# Altium schematic sheet ModMicroController.SchDoc
size 420 x 297 mm; Address1: Address1; Address2: Address2; Address3: Address3; Address4: Address4; SheetNumber: 1; Scale: 1:1; Разраб.: Лепотенко А.С.; Обозначение документа: ЛАС.4367523.002Э3; Перв. применение: ЛАС.4367523.002; Наименование изделия 1: Контроллер управления; Наименование изделия 2: Схема электрическая; Наименование изделия 3: принципиальная; Нач. отд.: Нач. отд.
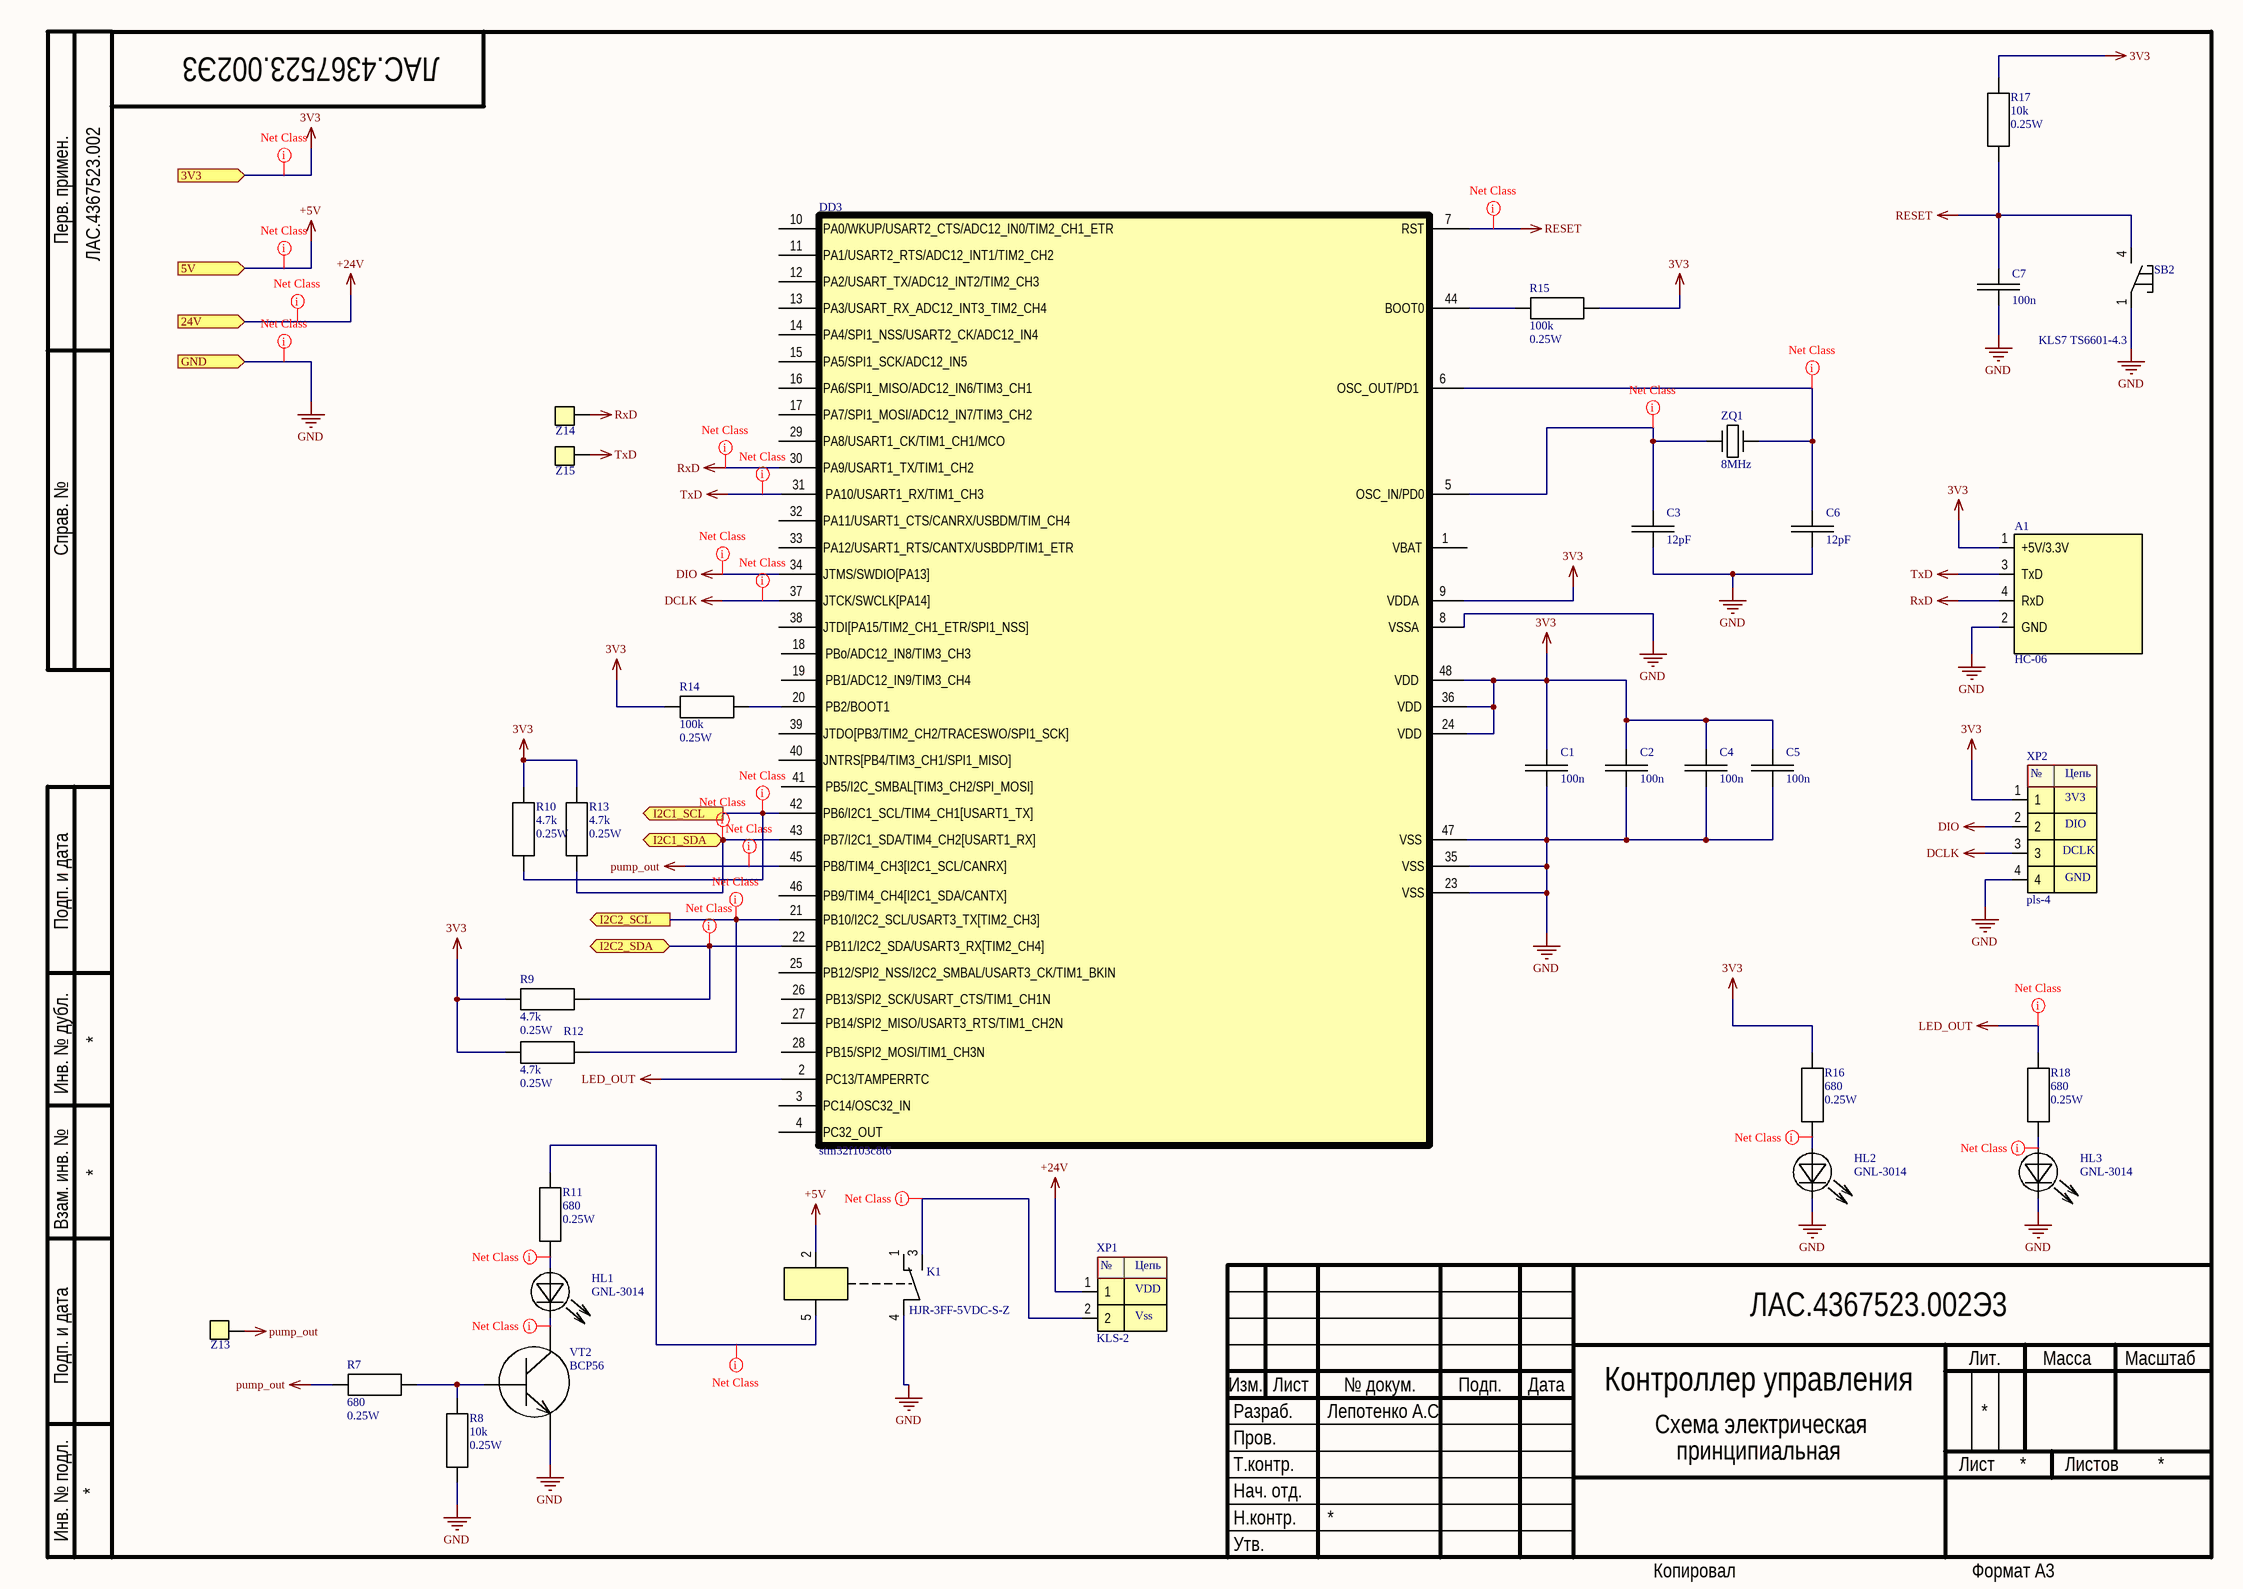
[diagram p0: ModMicroController.SchDoc]

## Parts
A1  HC-06  [HC-06]
C1  100n  [CAP1206]
C2  100n  [CAP1206]
C3  12pF  [CAP1206]
C4  100n  [CAP1206]
C5  100n  [CAP1206]
C6  12pF  [CAP1206]
C7  100n  [CAP1206]
DD3  stm32f103c8t6  [LQFP48]
HL1  GNL-3014  [GNL-3014]
HL2  GNL-3014  [GNL-3014]
HL3  GNL-3014  [GNL-3014]
K1  HJR-3FF-5VDC-S-Z  [HJR-3FF]
R7  Power: 0.25W  [1206]  (hidden comment: 680)
R8  Power: 0.25W  [1206]  (hidden comment: 10k)
R9  value 4.7k  Power: 0.25W  [1206]  (hidden comment: 4k7)
R10  value 4.7k  Power: 0.25W  [1206]  (hidden comment: 4k7)
R11  Power: 0.25W  [1206]  (hidden comment: 680)
R12  value 4.7k  Power: 0.25W  [1206]  (hidden comment: 4k7)
R13  value 4.7k  Power: 0.25W  [1206]  (hidden comment: 4k7)
R14  value 100k  Power: 0.25W  [1206]  (hidden comment: Resistor)
R15  value 100k  Power: 0.25W  [1206]  (hidden comment: Resistor)
R16  Power: 0.25W  [1206]  (hidden comment: 680)
R17  Power: 0.25W  [1206]  (hidden comment: 10k)
R18  Power: 0.25W  [1206]  (hidden comment: 680)
SB2  KLS7 TS6601-4.3  [KLS2]
VT2  BCP56  [SOT223]
XP1  KLS-2  [KLS2-EDR-500-2P]
XP2  pls-4  [Connector_STKLink]
Z13  test Point  [test Point]  (value not drawn)
Z14  test Point  [test Point]  (value not drawn)
Z15  test Point  [test Point]  (value not drawn)
ZQ1  8MHz  [HC-49US]

## Ports
3V3 (in), 5V (in), 24V (in), GND (in), I2C1_SCL (out), I2C1_SDA, I2C2_SCL (out), I2C2_SDA

## Nets
3V3: A1.1(+5V/3.3V) C1.1 C2.1 C4.1 C5.1 DD3.9(VDDA) DD3.24(VDD) DD3.36(VDD) DD3.48(VDD) R9.2 R10.2 R12.2 R13.2 R14.1 R15.2 R16.1 R17.2 XP2.1 ; port 3V3
+5V: K1.2 ; port 5V
+24V: XP1.1 ; port 24V
DCLK: DD3.37(JTCK/SWCLK[PA14]) XP2.3
DIO: DD3.34(JTMS/SWDIO[PA13]) XP2.2
GND: A1.2(GND) C1.2 C2.2 C3.2 C4.2 C5.2 C6.2 C7.2 DD3.8(VSSA) DD3.23(VSS) DD3.35(VSS) DD3.47(VSS) HL2.2 HL3.2 K1.4 R8.1 SB2.1 VT2.3 XP2.4 ; port GND
LED_OUT: DD3.2(PC13/TAMPERRTC) R18.1
pump_out: DD3.45(PB8/TIM4_CH3[I2C1_SCL/CANRX]) R7.2 Z13.1
RESET: C7.1 DD3.7(RST) R17.1 SB2.4
RxD: A1.4(RxD) DD3.30(PA9/USART1_TX/TIM1_CH2) Z14.1
TxD: A1.3(TxD) DD3.31(PA10/USART1_RX/TIM1_CH3) Z15.1
I2C1_SCL: DD3.42(PB6/I2C1_SCL/TIM4_CH1[USART1_TX]) R10.1 ; port I2C1_SCL
I2C1_SDA: DD3.43(PB7/I2C1_SDA/TIM4_CH2[USART1_RX]) R13.1 ; port I2C1_SDA
I2C2_SCL: DD3.21(PB10/I2C2_SCL/USART3_TX[TIM2_CH3]) R12.1 ; port I2C2_SCL
I2C2_SDA: DD3.22(PB11/I2C2_SDA/USART3_RX[TIM2_CH4]) R9.1 ; port I2C2_SDA
NetC3_1: C3.1 DD3.5(OSC_IN/PD0) ZQ1.1
NetC6_1: C6.1 DD3.6(OSC_OUT/PD1) ZQ1.2
NetDD3_20: DD3.20(PB2/BOOT1) R14.2
NetDD3_44: DD3.44(BOOT0) R15.1
NetHL1_1: HL1.1 R11.1
NetHL1_2: HL1.2 VT2.2
NetHL2_1: HL2.1 R16.2
NetHL3_1: HL3.1 R18.2
NetK1_3: K1.3 XP1.2
NetK1_5: K1.5 R11.2
NetR7_1: R7.1 R8.2 VT2.1

Not connected (* = marked no-connect by the designer): DD3 1(VBAT) 3(PC14/OSC32_IN) 4(PC32_OUT) 10(PA0/WKUP/USART2_CTS/ADC12_IN0/TIM2_CH1_ETR) 11(PA1/USART2_RTS/ADC12_INT1/TIM2_CH2) 12(PA2/USART_TX/ADC12_INT2/TIM2_CH3) 13(PA3/USART_RX_ADC12_INT3_TIM2_CH4) 14(PA4/SPI1_NSS/USART2_CK/ADC12_IN4) 15(PA5/SPI1_SCK/ADC12_IN5) 16(PA6/SPI1_MISO/ADC12_IN6/TIM3_CH1) 17(PA7/SPI1_MOSI/ADC12_IN7/TIM3_CH2) 18(PBo/ADC12_IN8/TIM3_CH3) 19(PB1/ADC12_IN9/TIM3_CH4) 25(PB12/SPI2_NSS/I2C2_SMBAL/USART3_CK/TIM1_BKIN) 26(PB13/SPI2_SCK/USART_CTS/TIM1_CH1N) 27(PB14/SPI2_MISO/USART3_RTS/TIM1_CH2N) 28(PB15/SPI2_MOSI/TIM1_CH3N) 29(PA8/USART1_CK/TIM1_CH1/MCO) 32(PA11/USART1_CTS/CANRX/USBDM/TIM_CH4) 33(PA12/USART1_RTS/CANTX/USBDP/TIM1_ETR) 38(JTDI[PA15/TIM2_CH1_ETR/SPI1_NSS]) 39(JTDO[PB3/TIM2_CH2/TRACESWO/SPI1_SCK]) 40(JNTRS[PB4/TIM3_CH1/SPI1_MISO]) 41(PB5/I2C_SMBAL[TIM3_CH2/SPI_MOSI]) 46(PB9/TIM4_CH4[I2C1_SDA/CANTX]); K1 1

## Layout directives
net class DigitalNet: DCLK, DIO, I2C1_SCL, I2C1_SDA, I2C2_SCL, I2C2_SDA, LED_OUT, NetC3_1, NetC6_1, NetHL3_1, pump_out, RESET, RxD, TxD
net class Power5V_3V3: 3V3, +5V, NetHL1_1, NetHL1_2, NetHL2_1, NetK1_5
net class Power24V: +24V, GND, NetK1_3

## Notes on the sheet
- Перв. примен.
- Справ. №
- Подп. и дата
- Инв. № дубл.
- Взам. инв. №
- Разраб.
- Изм.
- Лист
- № докум.
- Подп.
- Дата
- Лит.
- Масса
- Масштаб
- Пров.
- Т.контр.
- Листов
- Инв. № подл.
- Утв.
- Н.контр.
- Копировал
- Формат А3
- (in symbol Connector_Power) №; Цепь; VDD; Vss
- (in symbol Connector_STKLink) №; Цепь; 3V3; DIO; DCLK; GND

## Library data of the parts
A1 = HC-06: Manufacturer: china; Part Number: HC-06; Price: 5; Quantity: 1; Package: none
C1 C2 C4 C5 = Capasitor: Part Number: CL31B104KBCNNNC; Manufacturer: Samsung; Value: 100nF; Voltage: 50V; Quantity: 20; Package: 1206; Price: 0.035; ShoppingPlace: http://belchip.by/product/?selected_product=31093
C3 C6 = Capasitor: Part Number: 1206120NPO; Manufacturer: Samsung; Voltage: 50V; Value: 12pF; Quantity: 20; Package: 1206; Price: 0,025; ShoppingPlace: http://belchip.by/product/?selected_product=00255
C7 = Capasitor: Value: 100n; Voltage: *; Part Number: *; Quantity: *; Package: *; Price: *; Manufacturer: *; ShoppingPlace: *
DD3 = stm32f103c8t6: Manufacturer: STM; Value: MPU; Part Number: stm32f103c8t6; Price: 4; ShoppingPlace: http://belchip.by/product/?selected_product=10603; Package: LQFP48; Quantity: 1
HL1-HL3 = LED: Part Number: GNL-3014SRD; Manufacturer: G-NOR; Value: RED; Price: 0.04; Package: GNL; Quantity: 6; Shopping Place: http://belchip.by/product/?selected_product=00813
K1 = HJR-3FF-5VDC-S-Z: Manufacturer: TIANBO; Value: 5V; Part Number: HJR-3FF-5VDC-S-Z; Price: 0.6; ShoppingPlace: http://belchip.by/product/?selected_product=00571; Quantity: 1; Package: HJR-3FF
R7 R11 R16 R18 = Resistor: Manufacturer: YAGEO; Part Number: RC1206JR-07680RL; Quntity: 4; Price: 0,15; Package: 1206; ShoppingPlace: http://belchip.by/product/?selected_product=01380; Value: 680
R8 R17 = Resistor: Manufacturer: YAGEO; Part Number: RC1206FR-0710KL; Quntity: 4; Price: 0.15; Package: 1206; ShoppingPlace: http://belchip.by/product/?selected_product=30985; Value: 10k
R9 R10 R12 R13 = Resistor: Manufacturer: YAGEO; Part Number: RC1206JR-074K7L; Quntity: 4; Price: 0,15; Package: 1206; ShoppingPlace: http://belchip.by/product/?selected_product=01399
R14 R15 = Resistor: Manufacturer: YAGEO; Part Number: RC1206JR-07100KL; Quntity: 4; Price: 0,15; Package: 1206; ShoppingPlace: http://belchip.by/product/?selected_product=31131
SB2 = Button: Manufacturer: KLS; Value: 100VDC; Part Number: KLS7 TS6601-4.3; Price: 0,04; ShoppingPlace: http://belchip.by/product/?selected_product=02682; Quantity: 6; Package: KLS2
VT2 = BCP56-16: Manufacturer: NXP Semiconductors; Part Number: BCP56-16; Price: BCP56; ShoppingPlace: http://belchip.by/product/?selected_product=12583; Quantity: 2; Package: SOT223
XP1 = Connector_Power: Part Number: KLS2-EDR; Value: 1000VAC; Package: KLS2; Quantity: 2; Price: 0,13; ShoppingPlace: http://belchip.by/product/?selected_product=03190
XP2 = Connector_STKLink: Part Number: pls-40; Manufacturer: RUICHI; Value: 24VDC; Price: 0,12; Quantity: 2; shoppingPlace: http://belchip.by/product/?selected_product=02009
ZQ1 = Rzanator: Manufacturer: GEYER; Value: 8MHz; Part Number: HC-49US; Package: HC-49US; Quantity: 1; Price: 0,255; ShoppingPlace: http://belchip.by/product/?selected_product=33253